# Altium project ARM_PCB.PrjPcb
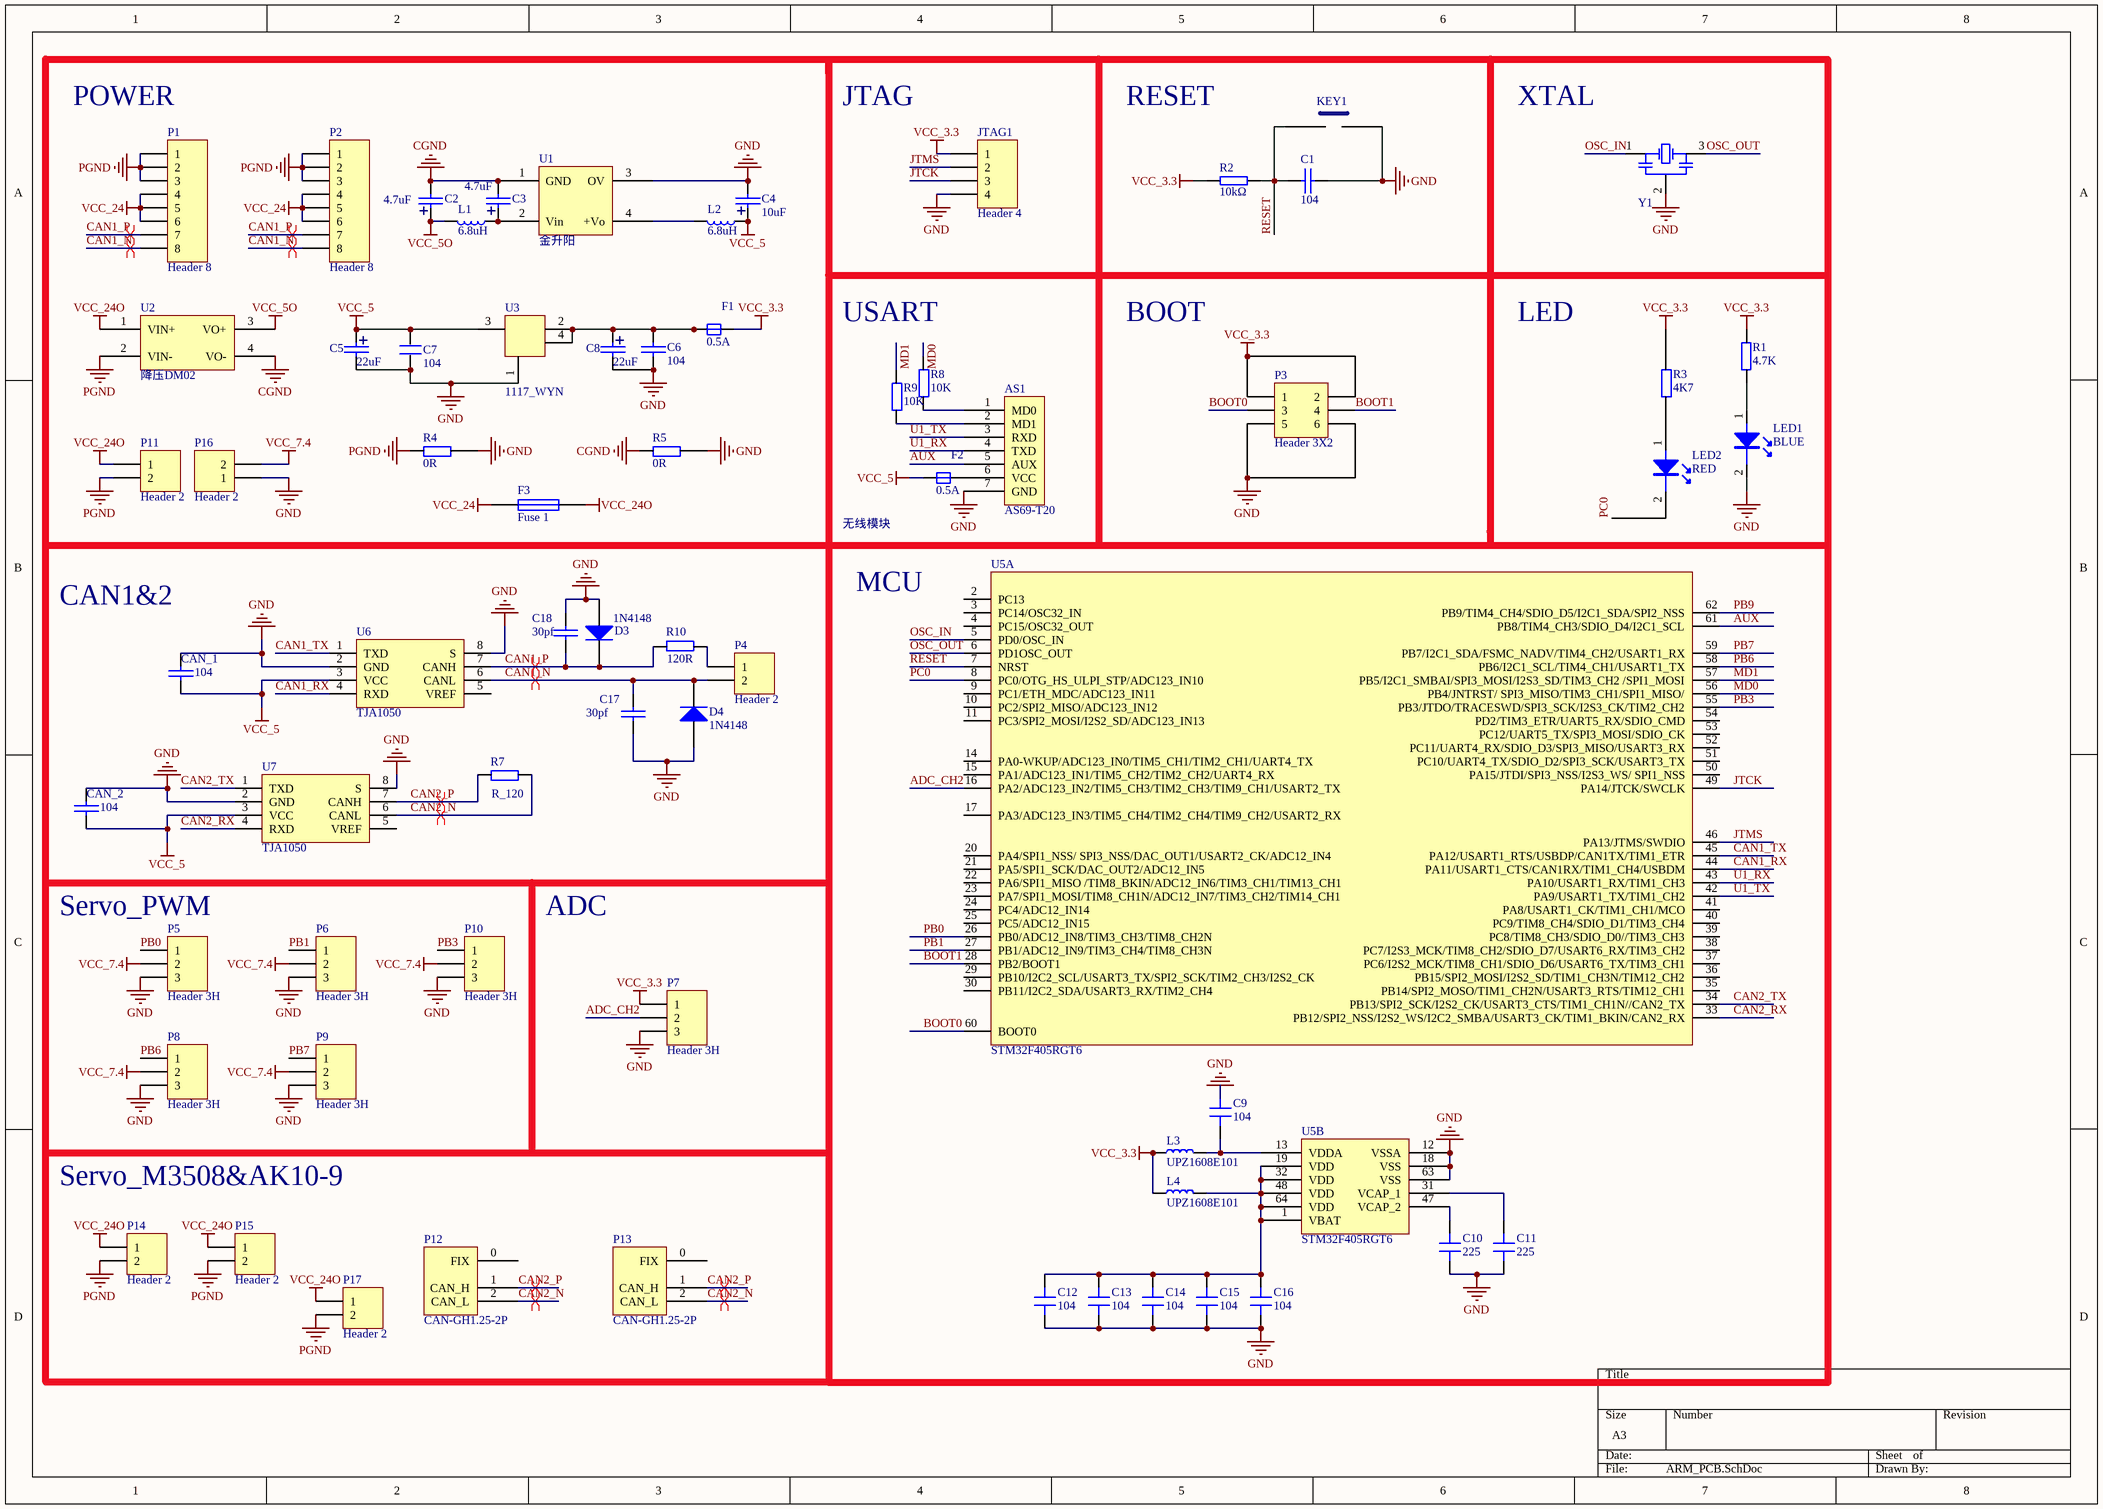
[diagram p0: ARM_PCB.SchDoc]
1 sheet, 67 parts. Net scope: global (net labels, ports and power ports of the same name join across sheets).
Board files: ARM_PCB.PcbDoc, ARM_PCB-2.PcbDoc

## Sheet ARM_PCB.SchDoc
size A3

### Parts
AS1  AS69-T20  [HDR2.54-M-LI-7P]
C1  104  [C0603]
C2  4.7uF  [A3216]
C3  4.7uF  [A3216]
C4  10uF  [A3216]
C5  22uF  [A3216]
C6  104  [C0603]
C7  104  [C0603]
C8  22uF  [A3216]
C9  104  [C0603/1608]
C10  225  [C0603/1608]
C11  225  [C0603/1608]
C12  104  [C0603/1608]
C13  104  [C0603/1608]
C14  104  [C0603/1608]
C15  104  [C0603/1608]
C16  104  [C0603/1608]
C17  30pf  [C0603]
C18  30pf  [C0603]
CAN_1  104  [C0603]
CAN_2  104  [C0603]
D3  1N4148  [MINI_MELF (LL34)]
D4  1N4148  [MINI_MELF (LL34)]
F1  0.5A  [L0603]
F2  0.5A  [L0603]
F3  Fuse 1  [Fuse]
JTAG1  Header 4  [Header1*4_XH2.54_zhi]
KEY1  KEY2  [KEY_RESET]  (value not drawn)
L1  6.8uH  [L0630]
L2  6.8uH  [L0630]
L3  UPZ1608E101  [L0603/1608]
L4  UPZ1608E101  [L0603/1608]
LED1  Color: BLUE  [LED0603]  (hidden comment: LED BLUE)
LED2  Color: RED  [LED0603]  (hidden comment: LED RED)
P1  Header 8  [XH2.54-WI-8P]
P2  Header 8  [Header1*8_XH2.54_zhi]
P3  Header 3X2  [BOOT]
P4  Header 2  [TM]
P5  Header 3H  [XH2.54-WI-3P]
P6  Header 3H  [XH2.54-WI-3P]
P7  Header 3H  [XH2.54-WI-3P]
P8  Header 3H  [XH2.54-WI-3P]
P9  Header 3H  [XH2.54-WI-3P]
P10  Header 3H  [XH2.54-WI-3P]
P11  Header 2  [KF301-5.0-2P]
P12  CAN-GH1.25-2P  [XH2.54-LI-2P]
P13  CAN-GH1.25-2P  [XH2.54-LI-2P]
P14  Header 2  [xt30公头（立式）]
P15  Header 2  [xt30公头（立式）]
P16  Header 2  [KF301-5.0-2P]
P17  Header 2  [XT30_母]
R1  4.7K  [R0603]
R2  10kΩ  [R0603]
R3  4K7  [R0603]
R4  0R  [R0603]
R5  0R  [R0603]
R7  R_120  [R0603]
R8  10K  [R0603]
R9  10K  [R0603]
R10  120R  [R0603]
U1  金升阳  [金升阳]
U2  降压DM02  [降压DM02]
U3  1117_WYN  [SOT-223]
U5  STM32F405RGT6  [LQFP64]  (parts A,B of 2)
U6  TJA1050  [SO8_M]
U7  TJA1050  [SO8_M]
Y1  Crystal_Cap  [XTAL-3213]  (value not drawn)

### Nets
CGND: C2.2 C3.2 R5.1 U1.1(GND) U2.4(VO-)
GND: AS1.7(GND) C1.2 C4.2 C5.2 C6.2 C7.1 C8.2 C9.2 C10.1 C11.1 C12.1 C13.1 C14.1 C15.1 C16.1 C17.2 C18.1 CAN_1.1 CAN_2.1 D3.1(A) D4.1(A) JTAG1.4 KEY1.1 LED1.2(K) P3.5 P3.6 P5.3 P6.3 P7.3 P8.3 P9.3 P10.3 P16.1 R4.2 R5.2 U1.3(OV) U3.1 U5.12(VSSA) U5.18(VSS) U5.63(VSS) U6.2(GND) U6.8(S) U7.2(GND) U7.8(S) Y1.2(OSC2)
PGND: P1.1 P1.2 P1.3 P2.1 P2.2 P2.3 P11.2 P14.2 P15.2 P17.2 R4.1 U2.2(VIN-)
VCC_3.3: F1.2 JTAG1.1 L3.1 L4.1 P3.1 P3.2 P7.1 R1.1 R2.2 R3.2
VCC_5: C4.1 C5.1 C7.2 CAN_1.2 CAN_2.2 F2.1 L2.1 U3.3 U6.3(VCC) U7.3(VCC)
VCC_5O: C2.1 L1.2 U2.3(VO+)
VCC_7.4: P5.2 P6.2 P8.2 P9.2 P10.2 P16.2
VCC_24: F3.1 P1.4 P1.5 P1.6 P2.4 P2.5 P2.6
VCC_24O: F3.2 P11.1 P14.1 P15.1 P17.1 U2.1(VIN+)
ADC_CH2: P7.2 U5.16(PA2/ADC123_IN2/TIM5_CH3/TIM2_CH3/TIM9_CH1/USART2_TX)
AUX: AS1.5(AUX) U5.61(PB8/TIM4_CH3/SDIO_D4/I2C1_SCL)
BOOT0: P3.3 U5.60(BOOT0)
BOOT1: P3.4 U5.28(PB2/BOOT1)
CAN1_N: C17.1 D4.2(K) P1.8 P2.8 P4.2 U6.6(CANL)
CAN1_P: C18.2 D3.2(K) P1.7 P2.7 R10.2 U6.7(CANH)
CAN1_RX: U5.44(PA11/USART1_CTS/CAN1RX/TIM1_CH4/USBDM) U6.4(RXD)
CAN1_TX: U5.45(PA12/USART1_RTS/USBDP/CAN1TX/TIM1_ETR) U6.1(TXD)
CAN2_N: P12.2(CAN_L) P13.2(CAN_L) R7.2 U7.6(CANL)
CAN2_P: P12.1(CAN_H) P13.1(CAN_H) R7.1 U7.7(CANH)
CAN2_RX: U5.33(PB12/SPI2_NSS/I2S2_WS/I2C2_SMBA/USART3_CK/TIM1_BKIN/CAN2_RX) U7.4(RXD)
CAN2_TX: U5.34(PB13/SPI2_SCK/I2S2_CK/USART3_CTS/TIM1_CH1N//CAN2_TX) U7.1(TXD)
JTCK: JTAG1.3 U5.49(PA14/JTCK/SWCLK)
JTMS: JTAG1.2 U5.46(PA13/JTMS/SWDIO)
MD0: R8.2 U5.56(PB4/JNTRST/_SPI3_MISO/TIM3_CH1/SPI1_MISO/)
MD1: R9.2 U5.57(PB5/I2C1_SMBAI/SPI3_MOSI/I2S3_SD/TIM3_CH2_/SPI1_MOSI)
OSC_IN: U5.5(PD0/OSC_IN) Y1.1(OSC1)
OSC_OUT: U5.6(PD1OSC_OUT) Y1.3(OSC3)
PB0: P5.1 U5.26(PB0/ADC12_IN8/TIM3_CH3/TIM8_CH2N)
PB1: P6.1 U5.27(PB1/ADC12_IN9/TIM3_CH4/TIM8_CH3N)
PB3: P10.1 U5.55(PB3/JTDO/TRACESWD/SPI3_SCK/I2S3_CK/TIM2_CH2)
PB6: P8.1 U5.58(PB6/I2C1_SCL/TIM4_CH1/USART1_TX)
PB7: P9.1 U5.59(PB7/I2C1_SDA/FSMC_NADV/TIM4_CH2/USART1_RX)
PB9: U5.62(PB9/TIM4_CH4/SDIO_D5/I2C1_SDA/SPI2_NSS)
PC0: LED2.2(K) U5.8(PC0/OTG_HS_ULPI_STP/ADC123_IN10)
RESET: C1.1 KEY1.2 R2.1 U5.7(NRST)
U1_RX: AS1.4(TXD) U5.43(PA10/USART1_RX/TIM1_CH3)
U1_TX: AS1.3(RXD) U5.42(PA9/USART1_TX/TIM1_CH2)
NetAS1_1: AS1.1(MD0) R8.1
NetAS1_2: AS1.2(MD1) R9.1
NetAS1_6: AS1.6(VCC) F2.2
NetC3_1: C3.1 L1.1 U1.2(Vin)
NetC6_1: C6.1 C8.1 F1.1 U3.2 U3.4
NetC9_1: C9.1 L3.2 U5.13(VDDA)
NetC10_2: C10.2 U5.47(VCAP_2)
NetC11_2: C11.2 U5.31(VCAP_1)
NetC12_2: C12.2 C13.2 C14.2 C15.2 C16.2 L4.2 U5.1(VBAT) U5.19(VDD) U5.32(VDD) U5.48(VDD) U5.64(VDD)
NetL2_2: L2.2 U1.4(+Vo)
NetLED1_1: LED1.1(A) R1.2
NetLED2_1: LED2.1(A) R3.1
NetP4_1: P4.1 R10.1

Not connected (* = marked no-connect by the designer): P12 0(FIX); P13 0(FIX); U5 2(PC13) 3(PC14/OSC32_IN) 4(PC15/OSC32_OUT) 9(PC1/ETH_MDC/ADC123_IN11) 10(PC2/SPI2_MISO/ADC123_IN12) 11(PC3/SPI2_MOSI/I2S2_SD/ADC123_IN13) 14(PA0-WKUP/ADC123_IN0/TIM5_CH1/TIM2_CH1/UART4_TX) 15(PA1/ADC123_IN1/TIM5_CH2/TIM2_CH2/UART4_RX) 17(PA3/ADC123_IN3/TIM5_CH4/TIM2_CH4/TIM9_CH2/USART2_RX) 20(PA4/SPI1_NSS/_SPI3_NSS/DAC_OUT1/USART2_CK/ADC12_IN4) 21(PA5/SPI1_SCK/DAC_OUT2/ADC12_IN5) 22(PA6/SPI1_MISO_/TIM8_BKIN/ADC12_IN6/TIM3_CH1/TIM13_CH1) 23(PA7/SPI1_MOSI/TIM8_CH1N/ADC12_IN7/TIM3_CH2/TIM14_CH1) 24(PC4/ADC12_IN14) 25(PC5/ADC12_IN15) 29(PB10/I2C2_SCL/USART3_TX/SPI2_SCK/TIM2_CH3/I2S2_CK) 30(PB11/I2C2_SDA/USART3_RX/TIM2_CH4) 35(PB14/SPI2_MOSO/TIM1_CH2N/USART3_RTS/TIM12_CH1) 36(PB15/SPI2_MOSI/I2S2_SD/TIM1_CH3N/TIM12_CH2) 37(PC6/I2S2_MCK/TIM8_CH1/SDIO_D6/USART6_TX/TIM3_CH1) 38(PC7/I2S3_MCK/TIM8_CH2/SDIO_D7/USART6_RX/TIM3_CH2) 39(PC8/TIM8_CH3/SDIO_D0//TIM3_CH3) 40(PC9/TIM8_CH4/SDIO_D1/TIM3_CH4) 41(PA8/USART1_CK/TIM1_CH1/MCO) 50(PA15/JTDI/SPI3_NSS/I2S3_WS/_SPI1_NSS) 51(PC10/UART4_TX/SDIO_D2/SPI3_SCK/USART3_TX) 52(PC11/UART4_RX/SDIO_D3/SPI3_MISO/USART3_RX) 53(PC12/UART5_TX/SPI3_MOSI/SDIO_CK) 54(PD2/TIM3_ETR/UART5_RX/SDIO_CMD); U6 5(VREF); U7 5(VREF)

### Layout directives
differential pair: CAN1_N, CAN1_P, CAN2_N, CAN2_P

### Notes on the sheet
- (near P1) POWER
- JTAG
- RESET
- XTAL
- USART
- BOOT
- LED
- 无线模块
- CAN1&2
- MCU
- (near P5) Servo_PWM
- ADC
- Servo_M3508&AK10-9

### Library data of the parts
C1 C6 C17 C18 CAN_1 CAN_2 = CAP_WYN
C2-C5 C8 = CAP_POL_WYN
C7 = Cap
C9-C16 = 陶瓷电容
D3 D4 = Diode: Default Diode; Published: 8-Jun-2000; LatestRevisionDate: 17-Jul-2002; LatestRevisionNote: Re-released for DXP Platform.; PackageVersion: Sep-1996; PackageReference: SMC; Publisher: Altium Limited; PackageDescription: DO-214-AB/SMC; 2 C-Bend Leads; Body 7.9 x 5.9 mm, inc. leads (LxW); Code_JEDEC: DO-214-AB
F1 F2 = FUSE
F3 = Fuse 1: Fuse; Published: 8-Jun-2000; LatestRevisionDate: 17-Jul-2002; LatestRevisionNote: Re-released for DXP Platform.; PackageReference: PIN-W2/E2.8; Publisher: Altium Limited; PackageDescription: Thru-Hole; 2 Leads
JTAG1 = Header 4: Header, 4-Pin; LatestRevisionDate: 17-Jul-2002; LatestRevisionNote: Re-released for DXP Platform.; Publisher: Altium Limited
KEY1 = KEY
L1-L4 = 磁珠: 贴片磁珠
LED1 LED2 = LED
P1 P2 = Header 8: Header, 8-Pin; LatestRevisionDate: 17-Jul-2002; LatestRevisionNote: Re-released for DXP Platform.; Publisher: Altium Limited
P3 = Header 3X2: Header, 3-Pin, Dual row; LatestRevisionDate: 17-Jul-2002; LatestRevisionNote: Re-released for DXP Platform.; Publisher: Altium Limited
P12 P13 = CAN-GH1.25-2P: CAN-GH1.25-2P端子座
R1 R7 = R
R2 = RES_WYN
R3-R5 R8-R10 = Resistor
U5 = STM32F405RGT6: 微控制器STM32F405RGT6
Y1 = Crystal_Cap: Published: 8-Jun-2000; LatestRevisionDate: 17-Jul-2002; LatestRevisionNote: Re-released for DXP Platform.; Publisher: Altium Limited